# EAGLE design Barker_project_02 (EAGLE 9.6.1)
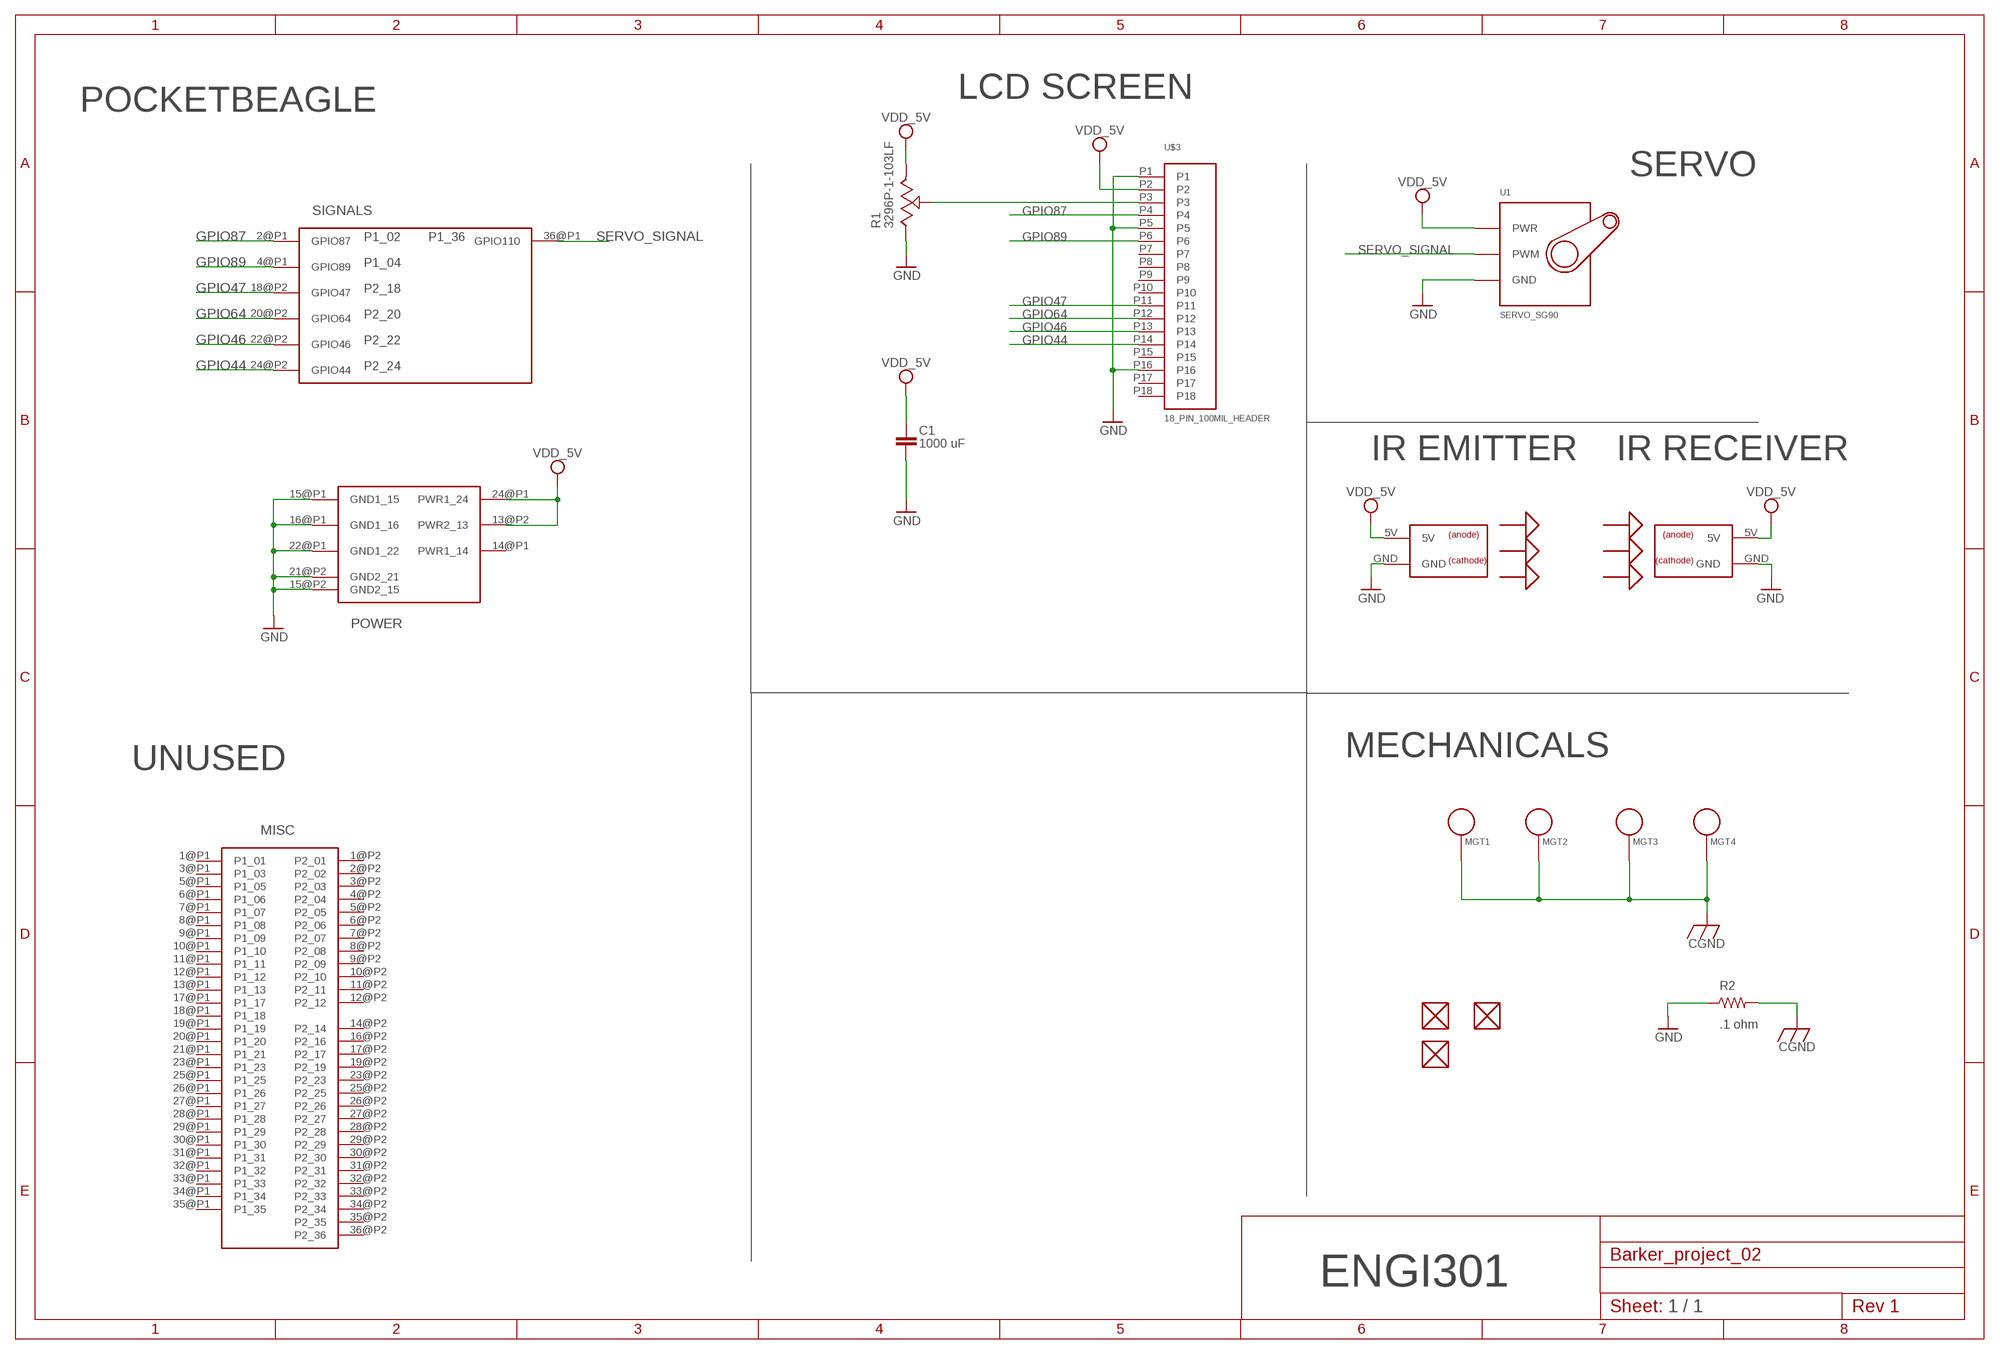
[diagram p0: schematic, sheet 1]

## Parts
C1  1000 uF  C_C0402  [C0402]
FUD1  FIDUCIAL  [FIDUCIAL_40MIL]
FUD2  FIDUCIAL  [FIDUCIAL_40MIL]
FUD3  FIDUCIAL  [FIDUCIAL_40MIL]
MGT1  MOUNTING_HOLE  [MOUNTING_HOLE]
MGT2  MOUNTING_HOLE  [MOUNTING_HOLE]
MGT3  MOUNTING_HOLE  [MOUNTING_HOLE]
MGT4  MOUNTING_HOLE  [MOUNTING_HOLE]
R1  3296P-1-103LF  [TRIM_3296P-1-103LF]
R2  .1 ohm  R_R0402  [R0402]
U1  SERVO_SG90  [SERVO-X1]
U2  POCKETBEAGLE  [POCKETBEAGLE]
U3  IR_EMITTER  [2_PIN_100MIL_HEADER]
U4  IR_DETECTOR  [2_PIN_100MIL_HEADER]
U$3  18_PIN_100MIL_HEADER  [18_PIN_100MIL_HEADER]

## Nets
CGND: MGT1.P$1 MGT2.P$1 MGT3.P$1 MGT4.P$1 R2.2
GND: C1.2 R1.1(CCW) R2.1 U1.GND U2.15@P1(GND1_15) U2.15@P2(GND2_15) U2.16@P1(GND1_16) U2.21@P2(GND2_21) U2.22@P1(GND1_22) U3.GND U4.GND U$3.P1 U$3.P5 U$3.P16
GPIO44: U2.24@P2(GPIO44) U$3.P14
GPIO46: U2.22@P2(GPIO46) U$3.P13
GPIO47: U2.18@P2(GPIO47) U$3.P11
GPIO64: U2.20@P2(GPIO64) U$3.P12
GPIO87: U2.2@P1(GPIO87) U$3.P4
GPIO89: U2.4@P1(GPIO89) U$3.P6
N$1: R1.2(WIPER) U$3.P3
SERVO_SIGNAL: U1.SIG(PWM) U2.36@P1(GPIO110)
VDD_5V: C1.1 R1.3(CW) U1.PWR U2.13@P2(PWR2_13) U2.24@P1(PWR1_24) U3.5V U4.5V U$3.P2
Unconnected: FUD1.P$1 FUD2.P$1 FUD3.P$1 U2.1@P1(P1_01) U2.1@P2(P2_01) U2.2@P2(P2_02) U2.3@P1(P1_03) U2.3@P2(P2_03) U2.4@P2(P2_04) U2.5@P1(P1_05) U2.5@P2(P2_05) U2.6@P1(P1_06) U2.6@P2(P2_06) U2.7@P1(P1_07) U2.7@P2(P2_07) U2.8@P1(P1_08) U2.8@P2(P2_08) U2.9@P1(P1_09) U2.9@P2(P2_09) U2.10@P1(P1_10) U2.10@P2(P2_10) U2.11@P1(P1_11) U2.11@P2(P2_11) U2.12@P1(P1_12) U2.12@P2(P2_12) U2.13@P1(P1_13) U2.14@P1(PWR1_14) U2.14@P2(P2_14) U2.16@P2(P2_16) U2.17@P1(P1_17) U2.17@P2(P2_17) U2.18@P1(P1_18) U2.19@P1(P1_19) U2.19@P2(P2_19) U2.20@P1(P1_20) U2.21@P1(P1_21) U2.23@P1(P1_23) U2.23@P2(P2_23) U2.25@P1(P1_25) U2.25@P2(P2_25) U2.26@P1(P1_26) U2.26@P2(P2_26) U2.27@P1(P1_27) U2.27@P2(P2_27) U2.28@P1(P1_28) U2.28@P2(P2_28) U2.29@P1(P1_29) U2.29@P2(P2_29) U2.30@P1(P1_30) U2.30@P2(P2_30) U2.31@P1(P1_31) U2.31@P2(P2_31) U2.32@P1(P1_32) U2.32@P2(P2_32) U2.33@P1(P1_33) U2.33@P2(P2_33) U2.34@P1(P1_34) U2.34@P2(P2_34) U2.35@P1(P1_35) U2.35@P2(P2_35) U2.36@P2(P2_36) U$3.P7 U$3.P8 U$3.P9 U$3.P10 U$3.P15 U$3.P17 U$3.P18

## Notes on the sheet
- LCD SCREEN
- POCKETBEAGLE
- SERVO
- SIGNALS
- IR EMITTER | IR RECEIVER
- POWER
- MECHANICALS
- UNUSED
- MISC
- ENGI301
- 1 / 1

## Library data of the parts
C1 = Barker_project_02:C_: Capacitor SMD. Sizes: 0402, 0603 & 0805
FUD1-FUD3 = Barker_project_02:FIDUCIAL
MGT1-MGT4 = Barker_project_02:MOUNTING_HOLE: Chassis Mounting Hole w/GND connection ability
R1 = Barker_project_02:3296P-1-103LF: 1 kOhms 0.5W, 1/2W PC Pins Through Hole Trimmer Potentiometer Cermet 25 Turn Side Adjustment Check availability <https://pricing.snapeda.com/parts/3296P-1-103LF/Bourns/view-part?ref=eda>; AVAILABILITY: In Stock; DESCRIPTION: 10 kOhms 0.5W, 1/2W PC Pins Through Hole Trimmer Potentiometer Cermet 25.0 Turn Side Adjustment; MF: Bourns; MP: 3296P-1-103LF; PACKAGE: QSOP-16 Bourns; PRICE: None; PURCHASE-URL: https://pricing.snapeda.com/search/part/3296P-1-103LF/?ref=eda
R2 = MISC:R_: RESISTOR, American symbol
U1 = Barker_project_02:SERVO_SG90
U2 = Barker_project_02:POCKETBEAGLE
U3 = Barker_project_02:IR_EMITTER
U4 = Barker_project_02:IR_DETECTOR
U$3 = Barker_project_02:18_PIN_100MIL_HEADER

## Board
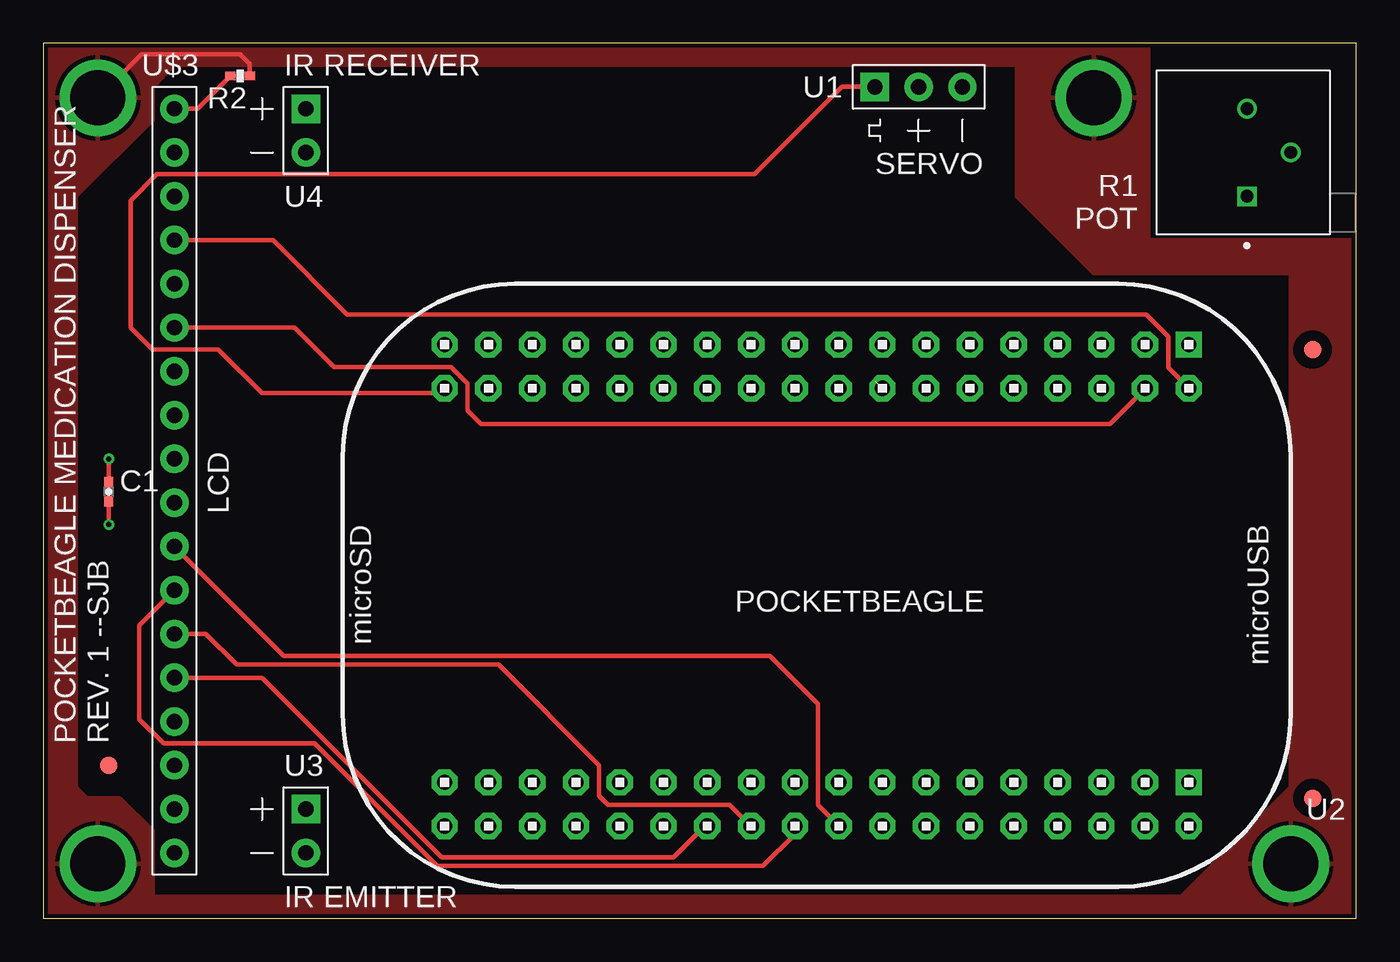
[diagram p1: board, top side]
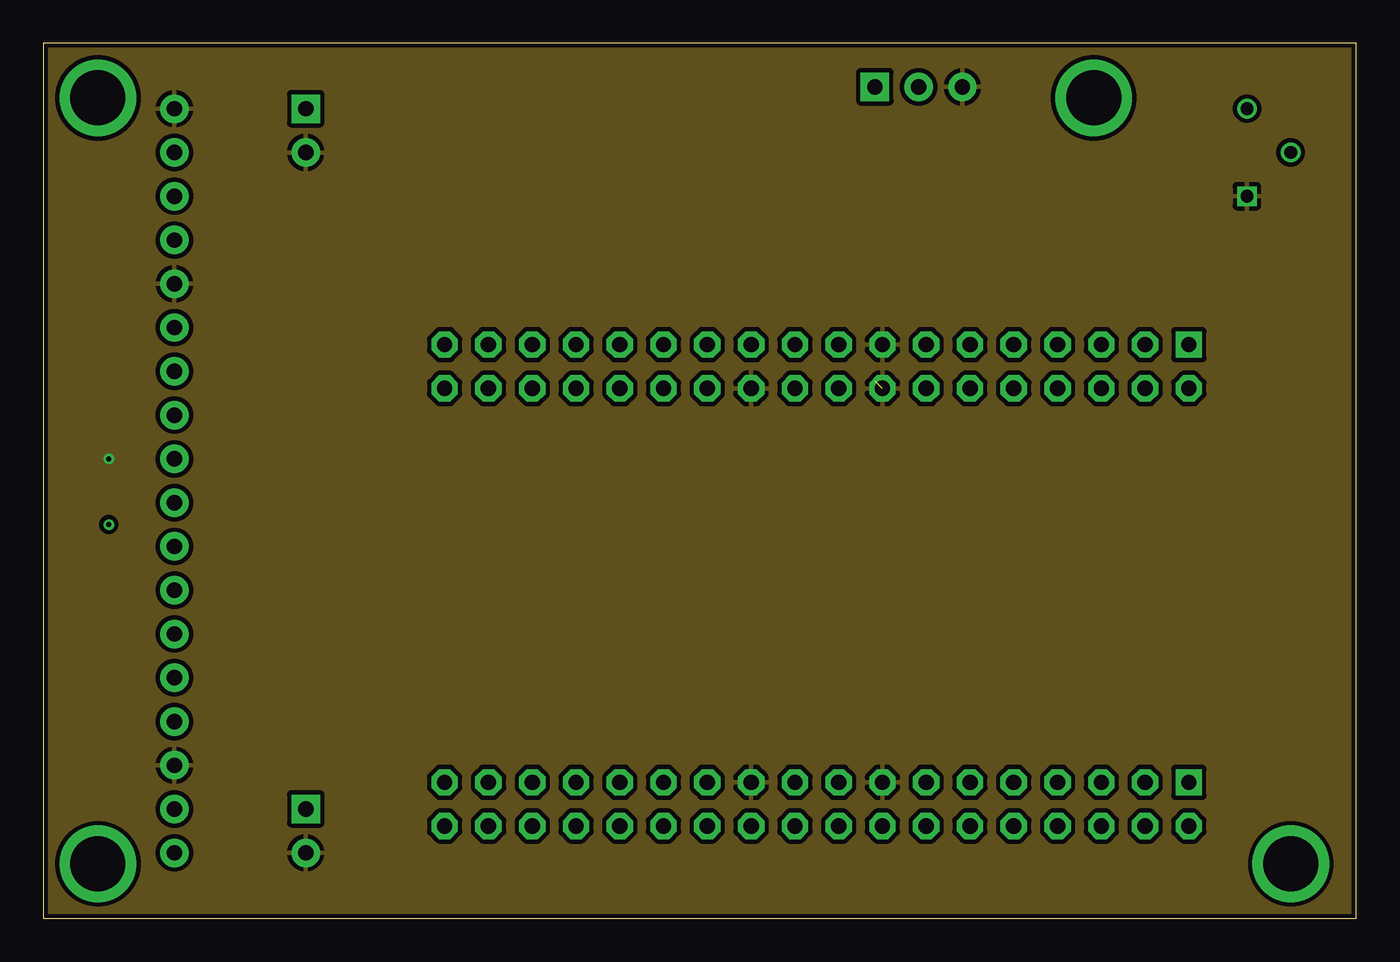
[diagram p2: board, inner layer Route2]
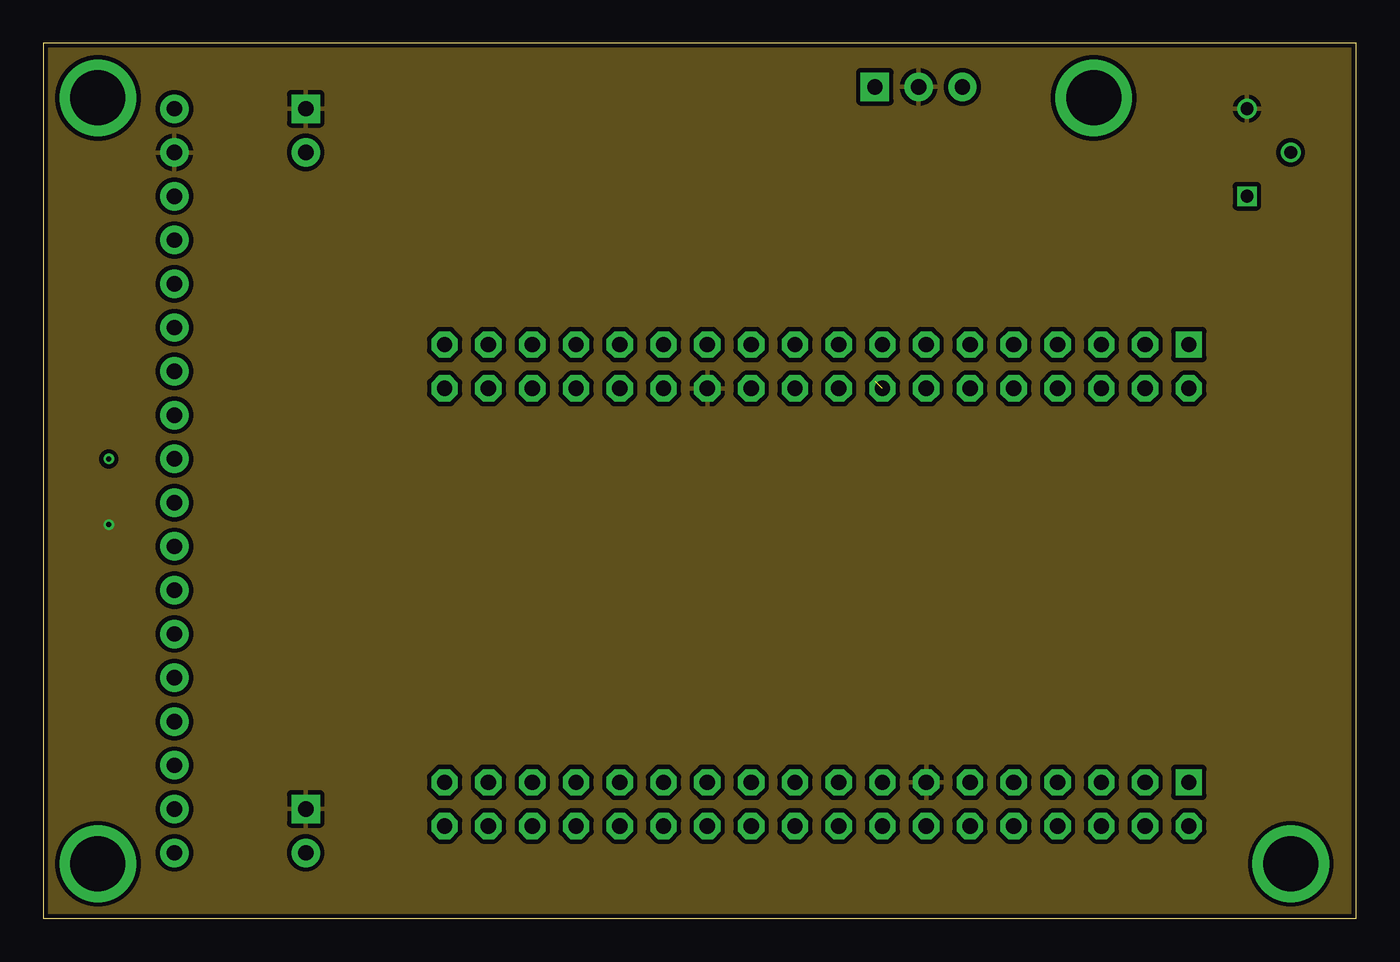
[diagram p3: board, inner layer Route15]
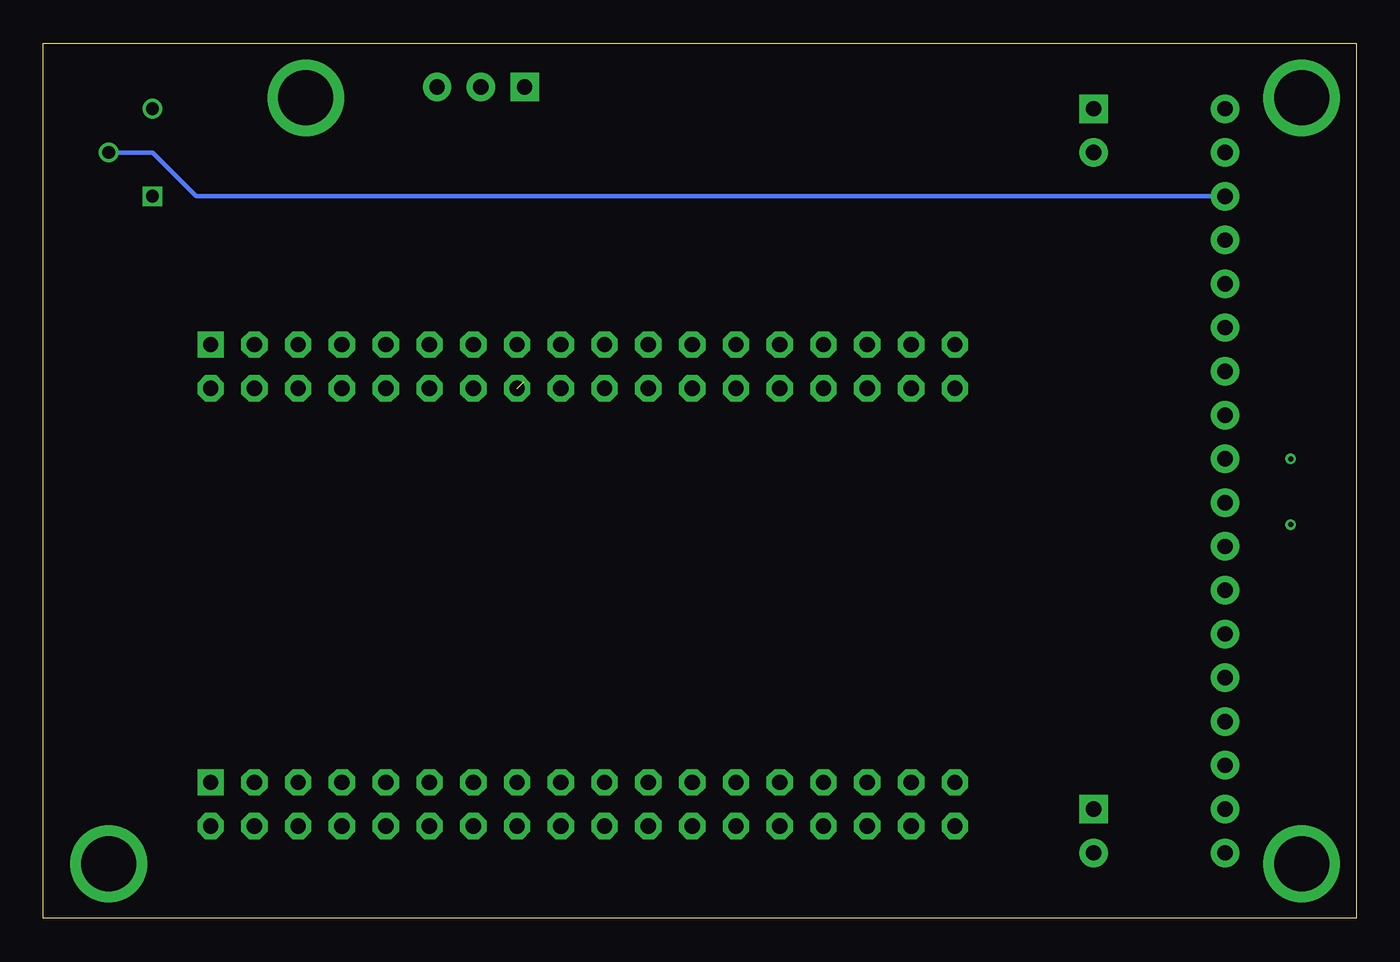
[diagram p4: board, bottom side, seen from below]

Size 76.2 x 50.8 mm. Coordinates in mm from the lower left corner, seen from the top.
Outline: 0,0 76.2,0 76.2,50.8 0,50.8 0,0
Copper layers (1*2*15*16): Top 0.035mm / dielectric 0.23mm / Route2 0.035mm / dielectric 0.93mm / Route15 0.035mm / dielectric 0.23mm / Bottom 0.035mm
Design rules "ENGI301_4lyr": minimum track width 10mil, minimum drill 12mil, track to track 10mil, track to pad 10mil, pad to pad 10mil, via to via 10mil, smd to smd 10mil, copper to edge 10mil, drill to drill 12mil, minimum pad ring 6mil, minimum via ring 6mil, stop-mask expansion 3mil, vias tented up to drill 25mil, thermal gap 10mil

### Footprints (pad centres in the part's own frame; a part is rotated, then mirrored left to right if it is on the bottom)
C0402 = smd 0.61 x 0.508: 1 -0.559,0; 2 0.559,0
FIDUCIAL_40MIL = smd 1.016 x 1.016: P$1 0,0
MOUNTING_HOLE = drill 3.175 pad 4.445: P$1 0,0
TRIM_3296P-1-103LF = drill 0.74 pad 1.14 square: 1 -2.54,0 | drill 0.74 pad 1.14: 2 0,-2.54; 3 2.54,0
R0402 = smd 0.61 x 0.508: 1 -0.559,0; 2 0.559,0
SERVO-X1 = drill 0.889 pad 1.651: GND 0,-2.54; PWR 0,0 | drill 0.889 pad 1.651 square: SIG 0,2.54
POCKETBEAGLE = drill 0.889 pad 1.524 square: 1@P1 5.91,3.53; 1@P2 5.91,28.93 | drill 0.889 pad 1.524 octagon: 2@P1 5.91,6.07; 2@P2 5.91,31.47; 3@P1 8.45,3.53; 3@P2 8.45,28.93; 4@P1 8.45,6.07; 4@P2 8.45,31.47; 5@P1 10.99,3.53; 5@P2 10.99,28.93; 6@P1 10.99,6.07; 6@P2 10.99,31.47; 7@P1 13.53,3.53; 7@P2 13.53,28.93; 8@P1 13.53,6.07; 8@P2 13.53,31.47; 9@P1 16.07,3.53; 9@P2 16.07,28.93; 10@P1 16.07,6.07; 10@P2 16.07,31.47; 11@P1 18.61,3.53; 11@P2 18.61,28.93; 12@P1 18.61,6.07; 12@P2 18.61,31.47; 13@P1 21.15,3.53; 13@P2 21.15,28.93; 14@P1 21.15,6.07; 14@P2 21.15,31.47; 15@P1 23.69,3.53; 15@P2 23.69,28.93; 16@P1 23.69,6.07; 16@P2 23.69,31.47; 17@P1 26.23,3.53; 17@P2 26.23,28.93; 18@P1 26.23,6.07; 18@P2 26.23,31.47; 19@P1 28.77,3.53; 19@P2 28.77,28.93; 20@P1 28.77,6.07; 20@P2 28.77,31.47; 21@P1 31.31,3.53; 21@P2 31.31,28.93; 22@P1 31.31,6.07; 22@P2 31.31,31.47; 23@P1 33.85,3.53; 23@P2 33.85,28.93; 24@P1 33.85,6.07; 24@P2 33.85,31.47; 25@P1 36.39,3.53; 25@P2 36.39,28.93; 26@P1 36.39,6.07; 26@P2 36.39,31.47; 27@P1 38.93,3.53; 27@P2 38.93,28.93; 28@P1 38.93,6.07; 28@P2 38.93,31.47; 29@P1 41.47,3.53; 29@P2 41.47,28.93; 30@P1 41.47,6.07; 30@P2 41.47,31.47; 31@P1 44.01,3.53; 31@P2 44.01,28.93; 32@P1 44.01,6.07; 32@P2 44.01,31.47; 33@P1 46.55,3.53; 33@P2 46.55,28.93; 34@P1 46.55,6.07; 34@P2 46.55,31.47; 35@P1 49.09,3.53; 35@P2 49.09,28.93; 36@P1 49.09,6.07; 36@P2 49.09,31.47
2_PIN_100MIL_HEADER = drill 0.889 pad 1.651 square: 5V 0,1.27 | drill 0.889 pad 1.651: GND 0,-1.27
18_PIN_100MIL_HEADER = drill 0.889 pad 1.651: P1 0,2.54; P2 0,0; P3 0,-2.54; P4 0,-5.08; P5 0,-7.62; P6 0,-10.16; P7 0,-12.7; P8 0,-15.24; P9 0,-17.78; P10 0,-20.32; P11 0,-22.86; P12 0,-25.4; P13 0,-27.94; P14 0,-30.48; P15 0,-33.02; P16 0,-35.56; P17 0,-38.1; P18 0,-40.64

### Placement (x,y rotation side)
C1  3.81,24.77 90 top
FUD1  3.81,8.89 0 top
FUD2  73.66,6.99 0 top
FUD3  73.66,33.02 0 top
MGT1  3.17,3.17 0 top
MGT2  3.17,47.62 0 top
MGT3  72.39,3.17 0 top
MGT4  60.96,47.62 0 top
R1  69.85,44.45 90 top
R2  11.43,48.9 0 top
U1  50.8,48.26 90 top
U2  72.39,36.83 180 top
U3  15.24,5.08 0 top
U4  15.24,45.72 0 top
U$3  7.62,44.45 0 top

### Tracks (layer width: path | path; a pad name or v marks a point on that pad's centre or on a via)
CGND
  Top 0.254: 11.97,48.9 R2.2 11.99,49.61 11.43,50.16 5.71,50.16 MGT2.P$1
  pour Top: -0.64,22.86 -0.64,-0.64 76.83,-0.64 76.83,26.67 72.39,26.67 72.39,7.62 66.04,1.27 6.35,1.27 6.35,5.08 4.45,6.99 2.54,6.99 1.91,7.62 1.91,22.86
  pour Top: -0.64,22.86 -0.64,52.07 64.14,52.07 64.14,39.37 76.83,39.37 76.83,26.67 72.39,26.67 72.39,37.47 60.96,37.47 56.52,41.91 56.52,49.53 7.62,49.53 6.35,48.26 6.35,46.35 1.91,41.91 1.91,22.86
GND  (via drill 0.3 pad 0.61)  (1 unrouted)
  Top 0.254: 48.3,31.16 48.26,31.2 | U$3.P16 7.68,8.83 | R2.1 8.97,46.99 U$3.P1 | C1.2 v3.81,26.67
  pour Route2: 81.28,55.88 -5.08,55.88 -5.08,-5.08 81.28,-5.08
GPIO44
  Top 0.254: U$3.P14 12.7,13.97 23.11,3.56 36.58,3.56 38.38,5.36 U2.24@P2
GPIO46
  Top 0.254: U$3.P13 9.44,16.51 11.22,14.73 26.42,14.73 32.26,8.89 32.26,7.11 32.77,6.6 39.84,6.6 U2.22@P2
GPIO47
  Top 0.254: U$3.P11 13.97,15.24 42.16,15.24 44.96,12.45 44.96,6.6 46.16,5.4 U2.18@P2
GPIO64
  Top 0.254: U$3.P12 5.59,17.02 5.59,11.56 6.99,10.16 15.75,10.16 22.86,3.05 41.78,3.05 43.62,4.88 U2.20@P2
GPIO87
  Top 0.254: U2.2@P1 65.28,31.96 65.28,33.78 64.01,35.05 17.65,35.05 13.34,39.37 U$3.P4
GPIO89
  Top 0.254: U2.4@P1 61.88,28.7 25.4,28.7 24.64,29.46 24.64,31.04 23.67,32 16.89,32 14.61,34.29 U$3.P6
N$1
  Bottom 0.254: R1.2 69.85,44.45 67.31,41.91 U$3.P3
SERVO_SIGNAL
  Top 0.254: U2.36@P1 23.02,30.48 12.7,30.48 10.16,33.02 6.35,33.02 5.08,34.29 5.08,41.66 6.6,43.18 41.27,43.18 46.35,48.26 U1.SIG
VDD_5V  (via drill 0.3 pad 0.61)
  Top 0.254: 6.99,44.45 U$3.P2 | C1.1 v3.81,22.86
  pour Route15: 78.74,53.34 -2.54,53.34 -2.54,-2.54 78.74,-2.54

### Text on the board
tPlace: POCKETBEAGLE MEDICATION DISPENSER / REV. 1 --SJB
tNames: IR RECEIVER | SERVO | POT | LCD | IR EMITTER